# Altium schematic sheet bms_AFE_R00.SchDoc
size A1
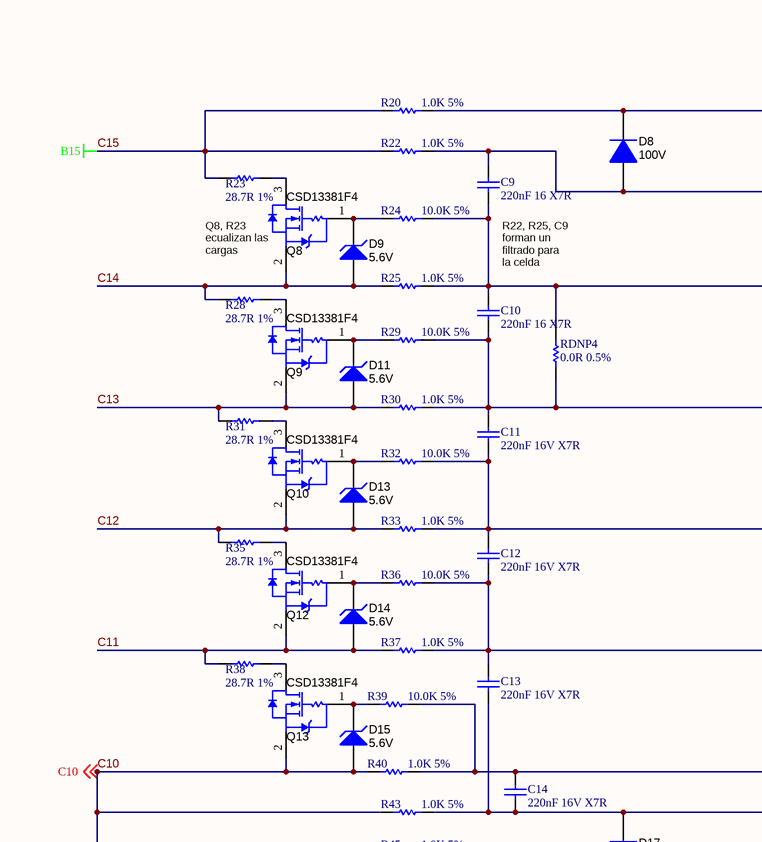
[diagram p0: bms_AFE_R00.SchDoc, top left]
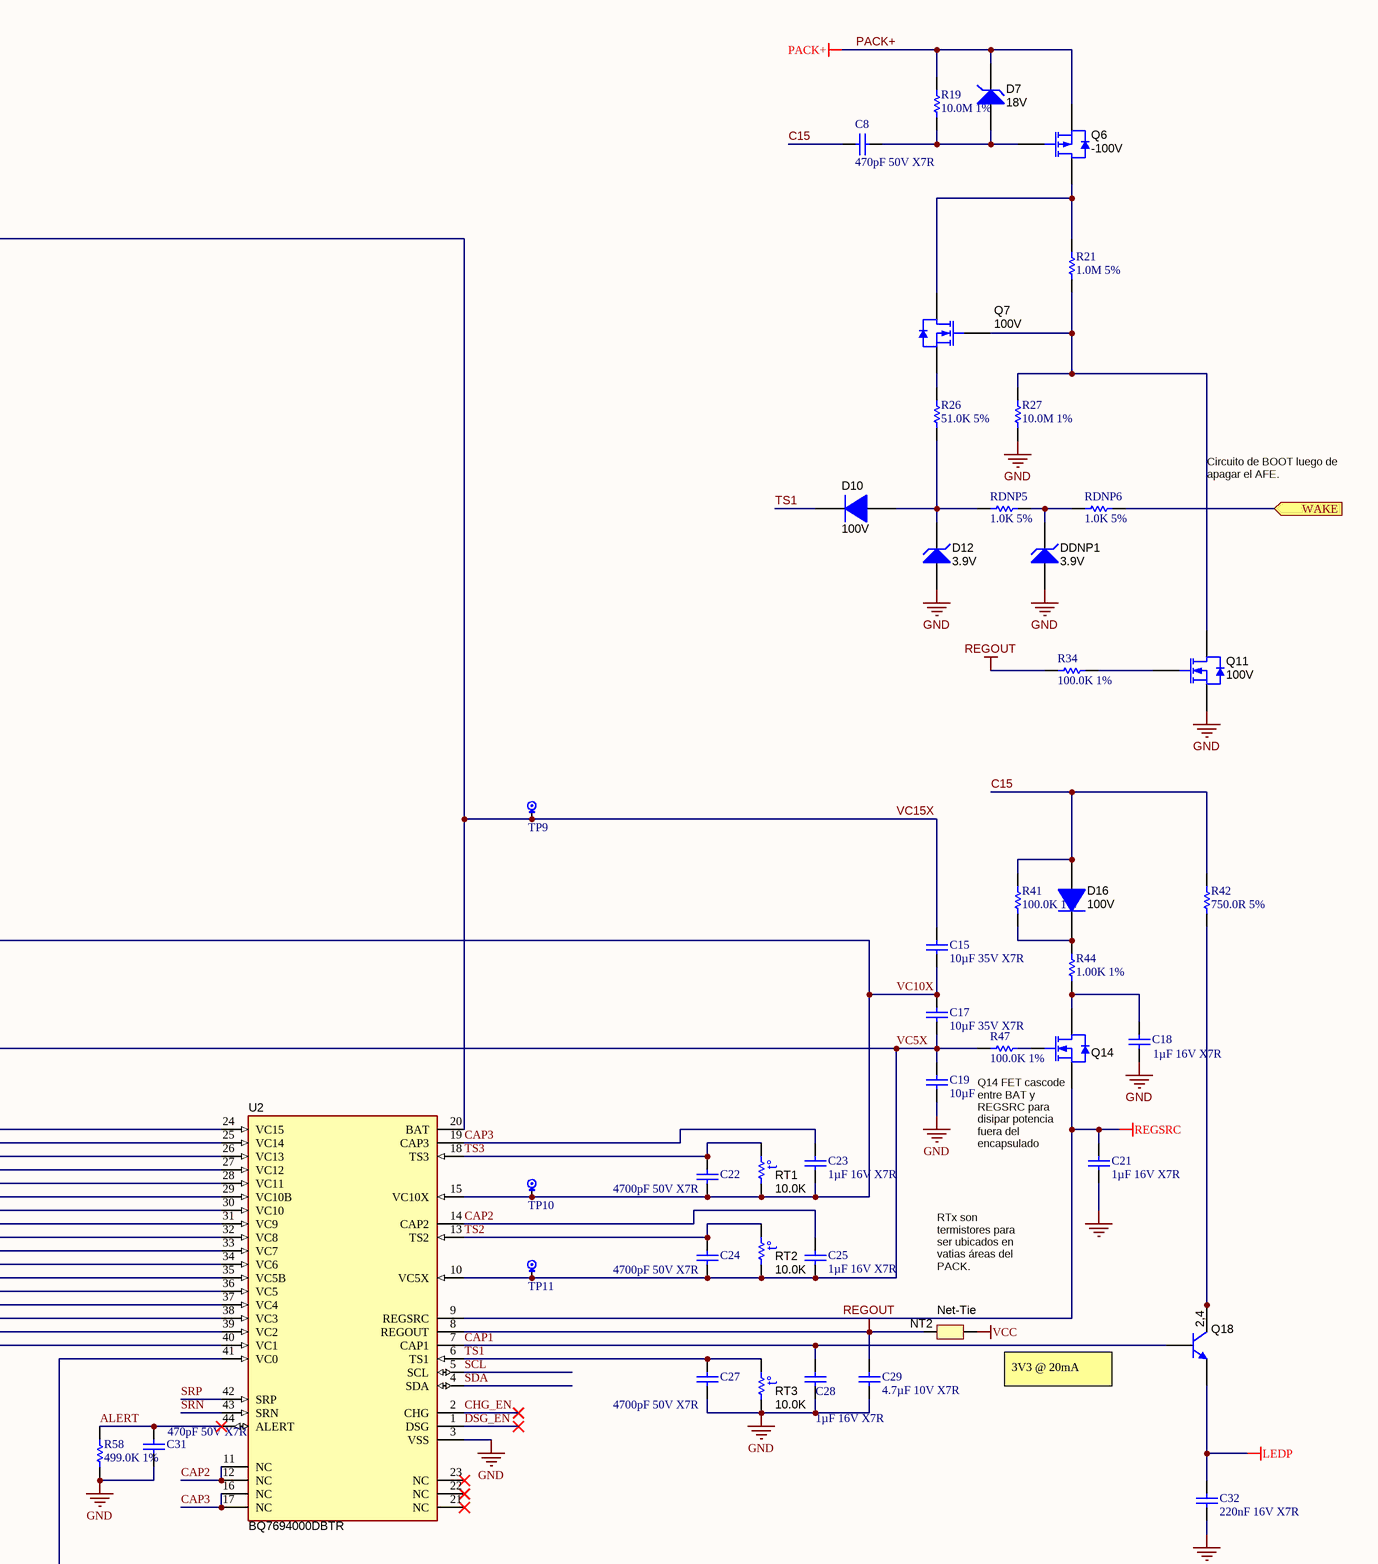
[diagram p1: bms_AFE_R00.SchDoc, top right]
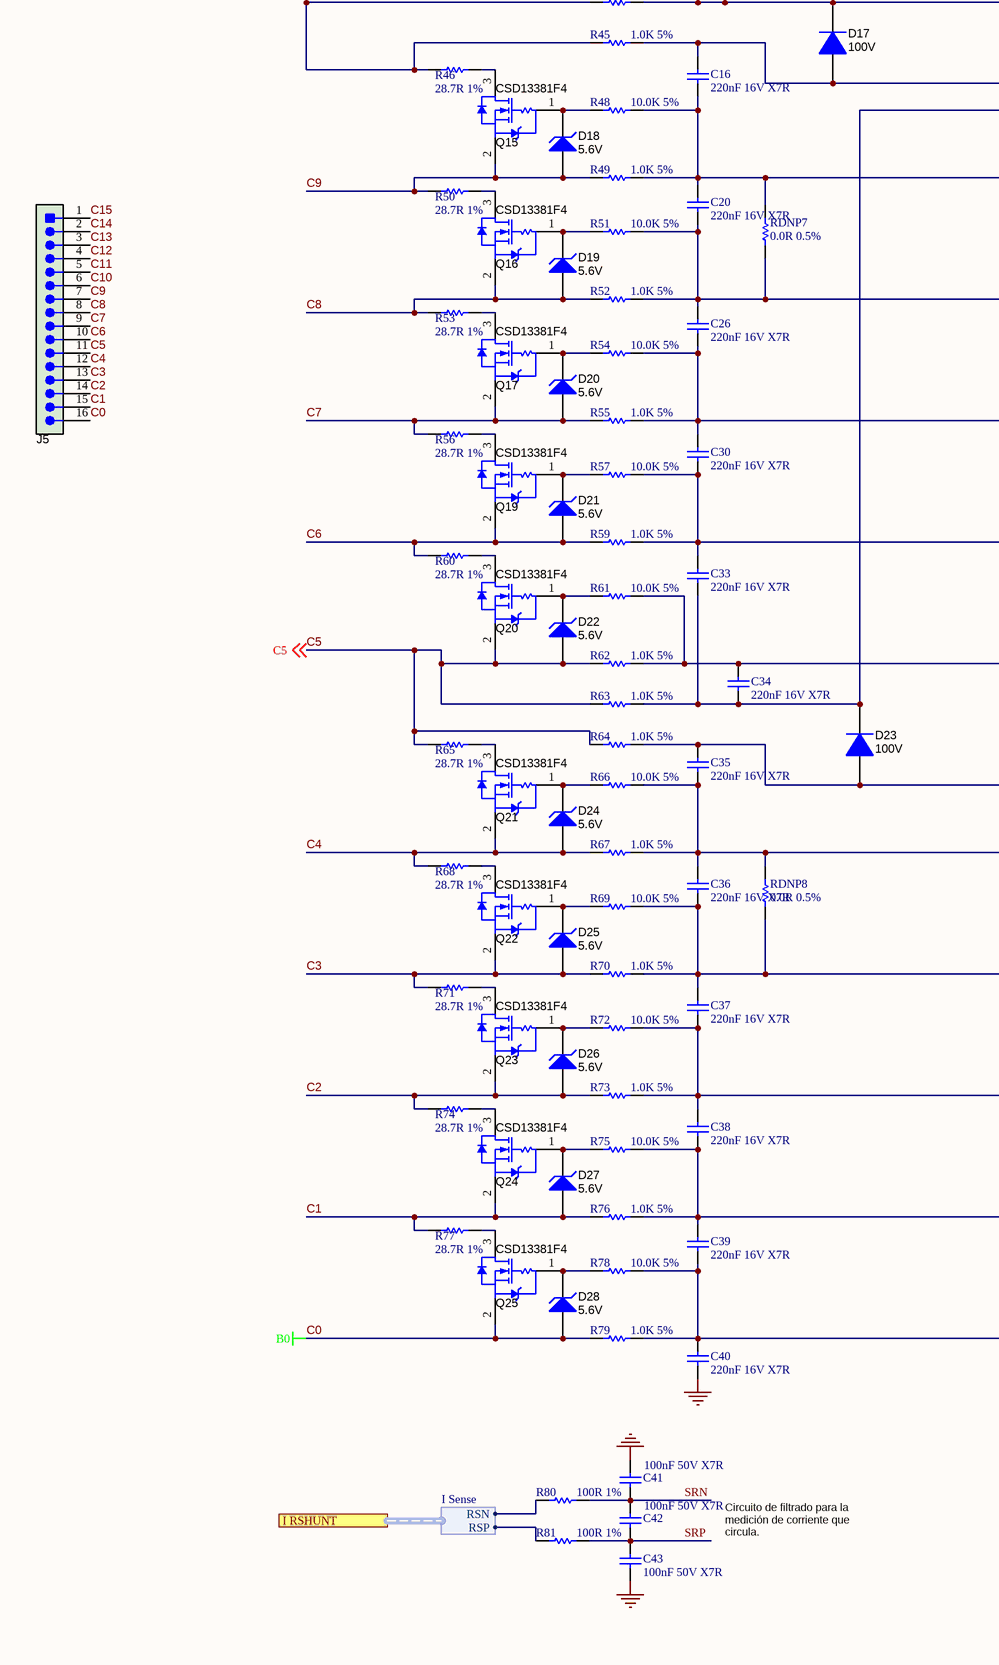
[diagram p2: bms_AFE_R00.SchDoc, bottom left]
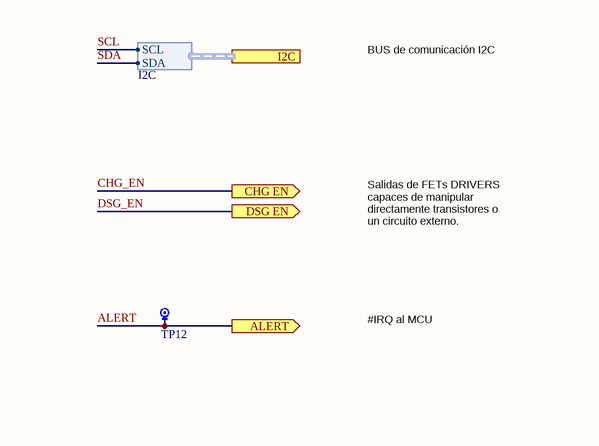
[diagram p3: bms_AFE_R00.SchDoc, bottom right]

## Parts
C8  470pF 50V X7R  [C0603]
C9  220nF 16 X7R  [C0603]
C10  220nF 16 X7R  [C0603]
C11  220nF 16V X7R  [C0603]
C12  220nF 16V X7R  [C0603]
C13  220nF 16V X7R  [C0603]
C14  220nF 16V X7R  [C0603]
C15  10µF 35V X7R  [1210_270]
C16  220nF 16V X7R  [C0603]
C17  10µF 35V X7R  [1210_270]
C18  1µF 16V X7R  [0805_HV_2]
C19  10µF  [1210_270]
C20  220nF 16V X7R  [C0603]
C21  1µF 16V X7R  [0805]
C22  4700pF 50V X7R  [C0603]
C23  1µF 16V X7R  [C0603]
C24  4700pF 50V X7R  [C0603]
C25  1µF 16V X7R  [C0603]
C26  220nF 16V X7R  [C0603]
C27  4700pF 50V X7R  [C0603]
C28  1µF 16V X7R  [C0603]
C29  4.7µF 10V X7R  [0805_HV_2]
C30  220nF 16V X7R  [C0603]
C31  470pF 50V X7R  [C0603]
C32  220nF 16V X7R  [C0603]
C33  220nF 16V X7R  [C0603]
C34  220nF 16V X7R  [C0603]
C35  220nF 16V X7R  [C0603]
C36  220nF 16V X7R  [C0603]
C37  220nF 16V X7R  [C0603]
C38  220nF 16V X7R  [C0603]
C39  220nF 16V X7R  [C0603]
C40  220nF 16V X7R  [C0603]
C41  100nF 50V X7R  [C0603]
C42  100nF 50V X7R  [C0603]
C43  100nF 50V X7R  [C0603]
D7  value 18V  [sod-323]  (hidden comment: MMSZ5248BS-7-F)
D8  value 100V  [SOD-123]  (hidden comment: 1N4148W-7-F)
D9  value 5.6V  [sod-323]  (hidden comment: MMSZ5232BS-7-F)
D10  value 100V  [SOD-123]  (hidden comment: 1N4148W-7-F)
D11  value 5.6V  [sod-323]  (hidden comment: MMSZ5232BS-7-F)
D12  value 3.9V  [sod-323]  (hidden comment: MMSZ5228BS-7-F)
D13  value 5.6V  [sod-323]  (hidden comment: MMSZ5232BS-7-F)
D14  value 5.6V  [sod-323]  (hidden comment: MMSZ5232BS-7-F)
D15  value 5.6V  [sod-323]  (hidden comment: MMSZ5232BS-7-F)
D16  value 100V  [SOD-123]  (hidden comment: 1N4148W-7-F)
D17  value 100V  [SOD-123]  (hidden comment: 1N4148W-7-F)
D18  value 5.6V  [sod-323]  (hidden comment: MMSZ5232BS-7-F)
D19  value 5.6V  [sod-323]  (hidden comment: MMSZ5232BS-7-F)
D20  value 5.6V  [sod-323]  (hidden comment: MMSZ5232BS-7-F)
D21  value 5.6V  [sod-323]  (hidden comment: MMSZ5232BS-7-F)
D22  value 5.6V  [sod-323]  (hidden comment: MMSZ5232BS-7-F)
D23  value 100V  [SOD-123]  (hidden comment: 1N4148W-7-F)
D24  value 5.6V  [sod-323]  (hidden comment: MMSZ5232BS-7-F)
D25  value 5.6V  [sod-323]  (hidden comment: MMSZ5232BS-7-F)
D26  value 5.6V  [sod-323]  (hidden comment: MMSZ5232BS-7-F)
D27  value 5.6V  [sod-323]  (hidden comment: MMSZ5232BS-7-F)
D28  value 5.6V  [sod-323]  (hidden comment: MMSZ5232BS-7-F)
DDNP1  value 3.9V  [sod-323]  (hidden comment: MMSZ5228BS-7-F)
J5  395021011  [HEADER_395021016]  (value not drawn)
NT2  Net-Tie  [Net-Tie_50milWide_30milLong]  (net tie, no BOM)
Q6  value -100V  [SOT-23]  (hidden comment: ZXMP10A13FTA)
Q7  value 100V  [SOT-23]  (hidden comment: BSS123)
Q8  CSD13381F4  [YJC0003A]
Q9  CSD13381F4  [YJC0003A]
Q10  CSD13381F4  [YJC0003A]
Q11  value 100V  [SOT-23]  (hidden comment: BSS123)
Q12  CSD13381F4  [YJC0003A]
Q13  CSD13381F4  [YJC0003A]
Q14  BST82,215  [SOT-23]  (value not drawn)
Q15  CSD13381F4  [YJC0003A]
Q16  CSD13381F4  [YJC0003A]
Q17  CSD13381F4  [YJC0003A]
Q18  ZXTN19100CZTA  [SOT-89-3]  (value not drawn)
Q19  CSD13381F4  [YJC0003A]
Q20  CSD13381F4  [YJC0003A]
Q21  CSD13381F4  [YJC0003A]
Q22  CSD13381F4  [YJC0003A]
Q23  CSD13381F4  [YJC0003A]
Q24  CSD13381F4  [YJC0003A]
Q25  CSD13381F4  [YJC0003A]
R19  10.0M 1%  [R0603]
R20  1.0K 5%  [R0603]
R21  1.0M 5%  [R0603]
R22  1.0K 5%  [R0603]
R23  28.7R 1%  [2512]
R24  10.0K 5%  [R0603]
R25  1.0K 5%  [R0603]
R26  51.0K 5%  [R0603]
R27  10.0M 1%  [R0603]
R28  28.7R 1%  [2512]
R29  10.0K 5%  [R0603]
R30  1.0K 5%  [R0603]
R31  28.7R 1%  [2512]
R32  10.0K 5%  [R0603]
R33  1.0K 5%  [R0603]
R34  100.0K 1%  [0805_HV_2]
R35  28.7R 1%  [2512]
R36  10.0K 5%  [R0603]
R37  1.0K 5%  [R0603]
R38  28.7R 1%  [2512]
R39  10.0K 5%  [R0603]
R40  1.0K 5%  [R0603]
R41  100.0K 1%  [0805_HV_2]
R42  750.0R 5%  [2010]
R43  1.0K 5%  [R0603]
R44  1.00K 1%  [2010]
R45  1.0K 5%  [R0603]
R46  28.7R 1%  [2512]
R47  100.0K 1%  [0805_HV_2]
R48  10.0K 5%  [R0603]
R49  1.0K 5%  [R0603]
R50  28.7R 1%  [2512]
R51  10.0K 5%  [R0603]
R52  1.0K 5%  [R0603]
R53  28.7R 1%  [2512]
R54  10.0K 5%  [R0603]
R55  1.0K 5%  [R0603]
R56  28.7R 1%  [2512]
R57  10.0K 5%  [R0603]
R58  499.0K 1%  [R0603]
R59  1.0K 5%  [R0603]
R60  28.7R 1%  [2512]
R61  10.0K 5%  [R0603]
R62  1.0K 5%  [R0603]
R63  1.0K 5%  [R0603]
R64  1.0K 5%  [R0603]
R65  28.7R 1%  [2512]
R66  10.0K 5%  [R0603]
R67  1.0K 5%  [R0603]
R68  28.7R 1%  [2512]
R69  10.0K 5%  [R0603]
R70  1.0K 5%  [R0603]
R71  28.7R 1%  [2512]
R72  10.0K 5%  [R0603]
R73  1.0K 5%  [R0603]
R74  28.7R 1%  [2512]
R75  10.0K 5%  [R0603]
R76  1.0K 5%  [R0603]
R77  28.7R 1%  [2512]
R78  10.0K 5%  [R0603]
R79  1.0K 5%  [R0603]
R80  100R 1%  [0805_HV_2]
R81  100R 1%  [0805_HV_2]
RDNP4  0.0R 0.5%  [R0603]
RDNP5  1.0K 5%  [R0603]
RDNP6  1.0K 5%  [R0603]
RDNP7  0.0R 0.5%  [R0603]
RDNP8  0.0R 0.5%  [R0603]
RT1  value 10.0K  [Thermistor_103AT-2]  (hidden comment: 103AT-2)
RT2  value 10.0K  [Thermistor_103AT-2]  (hidden comment: 103AT-2)
RT3  value 10.0K  [Thermistor_103AT-2]  (hidden comment: 103AT-2)
TP9  Test Point  [TEST POINT SMD 1]  (value not drawn)
TP10  Test Point  [TEST POINT SMD 1]  (value not drawn)
TP11  Test Point  [TEST POINT SMD 1]  (value not drawn)
TP12  Test Point  [TEST POINT SMD 1]  (value not drawn)
U2  BQ7694000DBTR  [DBT0044A_N]

## Ports
ALERT (out), CHG EN (out), DSG EN (out), I2C (harness I2C), I RSHUNT (harness I Sense), WAKE (in)

## Harnesses
I2C: SCL, SDA
I Sense: RSP, RSN

## Nets
C0: D28.2(A) J5.16 Q25.2(S) R79.1  [also labelled B0]
C15: C8.2 D16.2(A) J5.1 R20.1 R22.1 R23.2 R41.2 R42.2  [also labelled B15]
GND: C18.1 C19.1 C21.1 C27.1 C28.1 C29.1 C31.1 C32.1 C40.1 C41.2 C43.1 D12.2(A) DDNP1.2(A) Q11.2(S) R27.1 R58.1 RT3.1 U2.3(VSS)
LEDP: C32.2 Q18.3(E)
PACK+: D7.1(K) Q6.2(S) R19.2
REGOUT: C29.2 NT2.1 R34.2 U2.8(REGOUT)
REGSRC: C21.2 Q14.2(S) U2.9(REGSRC)
VCC: NT2.2
ALERT: C31.2 R58.2 TP12.1 U2.44(ALERT) ; port ALERT
C1: D27.2(A) J5.15 Q24.2(S) R76.1 R77.2
C2: D26.2(A) J5.14 Q23.2(S) R73.1 R74.2
C3: D25.2(A) J5.13 Q22.2(S) R70.1 R71.2
C4: D24.2(A) J5.12 Q21.2(S) R67.1 R68.2
C5: D22.2(A) J5.11 Q20.2(S) R62.1 R63.1 R64.1 R65.2 ; off-sheet C5
C6: D21.2(A) J5.10 Q19.2(S) R59.1 R60.2
C7: D20.2(A) J5.9 Q17.2(S) R55.1 R56.2
C8: D19.2(A) J5.8 Q16.2(S) R52.1 R53.2
C9: D18.2(A) J5.7 Q15.2(S) R49.1 R50.2
C10: D15.2(A) J5.6 Q13.2(S) R40.1 R43.1 R45.1 R46.2 ; off-sheet C10
C11: D14.2(A) J5.5 Q12.2(S) R37.1 R38.2
C12: D13.2(A) J5.4 Q10.2(S) R33.1 R35.2
C13: D11.2(A) J5.3 Q9.2(S) R30.1 R31.2
C14: D9.2(A) J5.2 Q8.2(S) R25.1 R28.2
CAP1: C28.2 Q18.1(B) U2.7(CAP1)
CAP2: C25.2 U2.11(NC) U2.12(NC) U2.14(CAP2)
CAP3: C23.2 U2.16(NC) U2.17(NC) U2.19(CAP3)
CHG_EN: U2.2(CHG) ; port CHG EN
DSG_EN: U2.1(DSG) ; port DSG EN
SCL: U2.5(SCL) ; port I2C.SCL
SDA: U2.4(SDA) ; port I2C.SDA
SRN: C41.1 C42.2 R80.2 U2.43(SRN)
SRP: C42.1 C43.2 R81.2 U2.42(SRP)
TS1: C27.2 D10.1(K) RT3.2 U2.6(TS1)
TS2: C24.2 RT2.2 U2.13(TS2)
TS3: C22.2 RT1.2 U2.18(TS3)
VC5X: C17.1 C19.2 C24.1 C25.1 C33.1 C34.1 D23.1(K) R47.1 R63.2 RT2.1 TP11.1 U2.10(VC5X)
VC10X: C13.1 C14.1 C15.1 C17.2 C22.1 C23.1 D17.1(K) R43.2 RT1.1 TP10.1 U2.15(VC10X)
VC15X: C15.2 D8.1(K) R20.2 TP9.1 U2.20(BAT)
WAKE: RDNP6.1 ; port WAKE
NetC8_1: C8.1 D7.2(A) Q6.1(G) R19.1
NetC9_1: C9.1 C10.2 R24.2 R25.2 RDNP4.2 U2.25(VC14)
NetC9_2: C9.2 D8.2(A) R22.2 U2.24(VC15)
NetC10_1: C10.1 C11.2 R29.2 R30.2 RDNP4.1 U2.26(VC13)
NetC11_1: C11.1 C12.2 R32.2 R33.2 U2.27(VC12)
NetC12_1: C12.1 C13.2 R36.2 R37.2 U2.28(VC11)
NetC14_2: C14.2 R39.2 R40.2 U2.29(VC10B)
NetC16_1: C16.1 C20.2 R48.2 R49.2 RDNP7.2 U2.31(VC9)
NetC16_2: C16.2 D17.2(A) R45.2 U2.30(VC10)
NetC18_2: C18.2 Q14.3(D) R44.1
NetC20_1: C20.1 C26.2 R51.2 R52.2 RDNP7.1 U2.32(VC8)
NetC26_1: C26.1 C30.2 R54.2 R55.2 U2.33(VC7)
NetC30_1: C30.1 C33.2 R57.2 R59.2 U2.34(VC6)
NetC34_2: C34.2 R61.2 R62.2 U2.35(VC5B)
NetC35_1: C35.1 C36.2 R66.2 R67.2 RDNP8.2 U2.37(VC4)
NetC35_2: C35.2 D23.2(A) R64.2 U2.36(VC5)
NetC36_1: C36.1 C37.2 R69.2 R70.2 RDNP8.1 U2.38(VC3)
NetC37_1: C37.1 C38.2 R72.2 R73.2 U2.39(VC2)
NetC38_1: C38.1 C39.2 R75.2 R76.2 U2.40(VC1)
NetC39_1: C39.1 C40.2 R78.2 R79.2 U2.41(VC0)
NetD9_1: D9.1(K) Q8.1(G) R24.1
NetD10_2: D10.2(A) D12.1(K) R26.1 RDNP5.2
NetD11_1: D11.1(K) Q9.1(G) R29.1
NetD13_1: D13.1(K) Q10.1(G) R32.1
NetD14_1: D14.1(K) Q12.1(G) R36.1
NetD15_1: D15.1(K) Q13.1(G) R39.1
NetD16_1: D16.1(K) R41.1 R44.2
NetD18_1: D18.1(K) Q15.1(G) R48.1
NetD19_1: D19.1(K) Q16.1(G) R51.1
NetD20_1: D20.1(K) Q17.1(G) R54.1
NetD21_1: D21.1(K) Q19.1(G) R57.1
NetD22_1: D22.1(K) Q20.1(G) R61.1
NetD24_1: D24.1(K) Q21.1(G) R66.1
NetD25_1: D25.1(K) Q22.1(G) R69.1
NetD26_1: D26.1(K) Q23.1(G) R72.1
NetD27_1: D27.1(K) Q24.1(G) R75.1
NetD28_1: D28.1(K) Q25.1(G) R78.1
NetDDNP1_1: DDNP1.1(K) RDNP5.1 RDNP6.2
NetQ6_3: Q6.3(D) Q7.3(D) R21.2
NetQ7_1: Q7.1(G) Q11.3(D) R21.1 R27.2
NetQ7_2: Q7.2(S) R26.2
NetQ8_3: Q8.3(D) R23.1
NetQ9_3: Q9.3(D) R28.1
NetQ10_3: Q10.3(D) R31.1
NetQ11_1: Q11.1(G) R34.1
NetQ12_3: Q12.3(D) R35.1
NetQ13_3: Q13.3(D) R38.1
NetQ14_1: Q14.1(G) R47.2
NetQ15_3: Q15.3(D) R46.1
NetQ16_3: Q16.3(D) R50.1
NetQ17_3: Q17.3(D) R53.1
NetQ18_2: Q18.2(C) Q18.4(C) R42.1
NetQ19_3: Q19.3(D) R56.1
NetQ20_3: Q20.3(D) R60.1
NetQ21_3: Q21.3(D) R65.1
NetQ22_3: Q22.3(D) R68.1
NetQ23_3: Q23.3(D) R71.1
NetQ24_3: Q24.3(D) R74.1
NetQ25_3: Q25.3(D) R77.1
NetR80_1: R80.1 ; port I RSHUNT.RSN
NetR81_1: R81.1 ; port I RSHUNT.RSP

Not connected (* = marked no-connect by the designer): U2 21(NC)* 22(NC)* 23(NC)*

## Notes on the sheet
- Q8, R23 ecualizan las cargas
- R22, R25, C9 forman un filtrado para la celda
- Circuito de BOOT luego de apagar el AFE.
- (near Q14) Q14 FET cascode entre BAT y REGSRC para disipar potencia fuera del encapsulado
- (near NT2) RTx son termistores para ser ubicados en vatias áreas del PACK.
- (near NT2) 3V3 @ 20mA
- BUS de comunicación I2C
- Salidas de FETs DRIVERS capaces de manipular directamente transistores o un circuito externo.
- #IRQ al MCU
- Circuito de filtrado para la medición de corriente que circula.
- (in symbol 103AT-2) t°
- (in symbol ZXTN19100CZTA, Diodes Inc.) 2,4

## Library data of the parts
C8-C14 C16 C20 C22-C28 C30-C43 = Cap 0603: Capacitor
C15 C17 C19 = Cap 1210: Capacitor
C18 C29 = Cap 0805_HV: Capacitor
C21 = Cap 0805: Capacitor
D7 = MMSZ5248BS-7-F: Diode, Zener, 18 V, 200 mW, SOD-323; Manufacturer: Diodes Inc.; SymbolCreator: a0412235; U/M: EA; Power_W: 0.2; Vz_V: 18; Value1: 0.2W; RJA_CperW: 350; AEC Category: Q101; SymbolVersion: 2010-08-25; PartNumber: MMSZ5248BS-7-F; PackageReference: SOD-323; CompType: Zener; Vr_V: N/A; MountType: SMT; RoHS: Y; ComponentLink1Description: Datasheet link; ComponentLink1URL: http://www.diodes.com/datasheets/ds31038.pdf; Published: 2008-10-08; Publisher: Texas Instruments; LatestRevisionDate: 2016-01-12; LatestRevisionNote: Updated Supplier Data; Supplier 1: Digi-Key; Supplier Part Number 1: MMSZ5248BS-FDICT-ND; Supplier 2: Mouser; Supplier Part Number 2: 621-MMSZ5248BS-F; Supplier 3: Farnell; Supplier Part Number 3: 1858632; AEC Qualified: ?
D8 D10 D16 D17 D23 = 1N4148W-7-F: Diode, Ultrafast, 100V, 0.15A, SOD-123; Manufacturer: Diodes Inc.; U/M: EA; Vf_V: 1.25; Io_A: 0.15; Vr_V: 100; Value2: 1.25V; TJmax_C: 150; ComponentLink1URL: http://www.diodes.com/datasheets/ds30086.pdf; SymbolVersion: 2008-12-08; PackageReference: SOD-123; PartNumber: 1N4148W-7-F; ComponentLink1Description: Datasheet link; CompType: Diode; MountType: SMT; RoHS: Y; Value1: 0.15A; Type: Ultrafast; Published: 2008-06-26; Publisher: Texas Instruments; LatestRevisionDate: 2013-10-23; Supplier 1: Digi-Key; Supplier Part Number 1: 1N4148W-FDICT-ND; Supplier 2: Mouser; Supplier Part Number 2: 621-1N4148W-F; Supplier 3: Farnell; Supplier Part Number 3: 1776392
D9 D11 D13-D15 D18-D22 D24-D28 = MMSZ5232BS-7-F: Diode, Zener, 5.6V, 200mW, SOD-323; Manufacturer: Diodes Inc.; U/M: EA; Power_W: 0.2; Vz_V: 5.6; Value1: 0.2W; RJA_CperW: 350; CompType: Zener; SymbolVersion: 2010-08-25; PartNumber: MMSZ5232BS-7-F; PackageReference: SOD-323; Vr_V: N/A; MountType: SMT; RoHS: Y; ComponentLink1Description: Datasheet link; ComponentLink1URL: http://www.diodes.com/datasheets/ds31038.pdf; Published: 2008-10-08; Publisher: Texas Instruments; LatestRevisionDate: 2013-02-11; LatestRevisionNote: Updated Supplier Data; Supplier 1: Digi-Key; Supplier Part Number 1: MMSZ5232BS-FDICT-ND; Supplier 2: Mouser; Supplier Part Number 2: 621-MMSZ5232BS-F
D12 DDNP1 = MMSZ5228BS-7-F: Diode, Zener, 3.9 V, 200 mW, SOD-323; Manufacturer: Diodes Inc.; SymbolCreator: a0412235; U/M: EA; Power_W: 0.2; Vz_V: 3.9; Value1: 0.2W; RJA_CperW: 350; AEC Category: Q101; SymbolVersion: 2010-08-25; PartNumber: MMSZ5228BS-7-F; PackageReference: SOD-323; CompType: Zener; Vr_V: N/A; MountType: SMT; RoHS: Y; ComponentLink1Description: Datasheet link; ComponentLink1URL: http://www.diodes.com/datasheets/ds31038.pdf; Published: 2008-10-08; Publisher: Texas Instruments; LatestRevisionDate: 2016-04-07; LatestRevisionNote: Updated Supplier Data; Supplier 1: Digi-Key; Supplier Part Number 1: MMSZ5228BS-FDICT-ND; Supplier 2: Mouser; Supplier Part Number 2: 621-MMSZ5228BS-F; AEC Qualified: ?
J5 = 395021016: Terminal block, 3.5mm, 16x1, R/A, TH; Manufacturer: Molex; SymbolCreator: a0799628; U/M: EA; SymbolVersion: 2013-12-22; PartNumber: 395021011; PackageReference: 39.90x7.03x9.33 mm; CompType: Terminal Block; RoHS: Y; MountType: TH; ComponentLink1Description: Datasheet Link; ComponentLink1URL: http://www.molex.com/pdm_docs/sd/395021002_sd.pdf; Publisher: Texas Instruments; LatestRevisionDate: 2015-02-18; Supplier 1: Digi-Key; Supplier Part Number 1: WM7779-ND; Supplier 2: Mouser; Supplier Part Number 2: 538-39502-1011
NT2 = Net-Tie: Single point connection between nets.; SymbolCreator: codlsc; SymbolVersion: 2009-07-01; MountType: SMT; PackageReference: N/A; Publisher: Texas Instruments; LatestRevisionDate: 2015-10-18; LatestRevisionNote: Added Alternate PartNumber and Alternate Manufacturer parameters to appropriate components.
Q6 = ZXMP10A13FTA: MOSFET, P-CH, -100V, -0.6A, SOT-23; Manufacturer: Diodes Inc.; Alternate Manufacturer: None; U/M: EA; ChType: P; VdsMax_V: -100; Value1: 1 ohm; Rdson45_Ohm: 1; Value2: 3.5 nC; QgTyp_nC: 3.5; Vgs_V: -4; IdsMax_A: -0.6; SymbolVersion: 2008-07-09; PartNumber: ZXMP10A13FTA; PackageReference: SOT-23; CompType: MOSFET; RoHS: Y; MountType: SMT; Published: 2008-06-19; Publisher: Texas Instruments; LatestRevisionDate: 2013-12-01; LatestRevisionNote: Added parts.; ComponentLink1Description: Datasheet link; ComponentLink1URL: http://www.diodes.com/datasheets/ZXMP10A13F.pdf; Supplier 1: Digi-Key; Supplier Part Number 1: ZXMP10A13FCT-ND; Supplier 2: Mouser; Supplier Part Number 2: 522-ZXMP10A13FTA; Supplier 3: Farnell; Supplier Part Number 3: 1843777
Q7 Q11 = BSS123: MOSFET, N-CH, 100V, 0.17A, SOT-23; Manufacturer: Fairchild Semiconductor; Alternate Manufacturer: None; U/M: EA; ChType: N; VdsMax_V: 100; Value1: 10 ohm; Rdson45_Ohm: 10; Value2: 1.8 nC; QgTyp_nC: 1.8; Vgs_V: 20; IdsMax_A: 0.17; SymbolVersion: 2008-07-28; CompType: MOSFET; PartNumber: BSS123; PackageReference: SOT-23; RoHS: Y; MountType: SMT; Published: 2008-06-19; Publisher: Texas Instruments; LatestRevisionDate: 2013-10-21; LatestRevisionNote: Added parts.; ComponentLink1Description: Datasheet link; ComponentLink1URL: http://www.fairchildsemi.com/ds/BS/BSS123.pdf; Supplier 1: Digi-Key; Supplier Part Number 1: BSS123NCT-ND; Supplier 2: Mouser; Supplier Part Number 2: 512-BSS123; Supplier 3: Farnell; Supplier Part Number 3: 9845321
Q8-Q10 Q12 Q13 Q15-Q17 Q19-Q25 = CSD13381F4: MOSFET, N/P-CH, 12 V, 2.1 A, 1.0x0.35x0.6mm; Manufacturer: Texas Instruments; Alternate Manufacturer: None; SymbolCreator: a0411947; U/M: EA; ChType: N; Value: 12V; VdsMax_V: 12; Value1: 0.14 ohm; Rdson45_ohm: 0.14; Value2: 1.06 nC; QgTyp_nC: 1.06; Vgs_V: 8; IdsMax_A: 2.1; SymbolVersion: 2013-11-21; PartNumber: CSD13381F4; PackageReference: 1.0x0.35x0.6mm; CompType: MOSFET; RoHS: Y; MountType: SMT; Published: 2008-06-19; Publisher: Texas Instruments; LatestRevisionDate: 2015-02-19; LatestRevisionNote: Added parts.; ComponentLink1Description: Datasheet link; ComponentLink1URL: http://www.ti.com/lit/ds/symlink/csd13381f4.pdf; Supplier 1: Digi-Key; Supplier Part Number 1: CSD13381F4-ND; Supplier 2: Mouser; Supplier Part Number 2: 595-CSD13381F4; Supplier 3: Newark; Supplier Part Number 3: 11X3112
Q14 = BST82,215: MOSFET, N-CH, 100 V, 0.19 A, SOT-23; Manufacturer: NXP Semiconductor; Alternate Manufacturer: None; U/M: EA; ChType: N; Value: 100V; VdsMax_V: 100; Value1: 10 ohm; Rdson45_ohm: 10; Value2: ? nC; Vgs_V: 20; IdsMax_A: 0.19; AEC Category: Q101; SymbolVersion: 2008-07-28; CompType: MOSFET; PartNumber: BST82,215; PackageReference: SOT-23; RoHS: Y; MountType: SMT; Published: 2008-06-19; Publisher: Texas Instruments; LatestRevisionDate: 2016-03-03; LatestRevisionNote: Added parts.; ComponentLink1Description: Datasheet link; ComponentLink1URL: http://www.nxp.com/documents/data_sheet/BST82.pdf; Supplier 1: Digi-Key; Supplier Part Number 1: 568-6229-1-ND; Supplier 2: Mouser; Supplier Part Number 2: 771-BST82215; Supplier 3: Newark; Supplier Part Number 3: 75R4704; AEC Qualified: ?
Q18 = ZXTN19100CZTA, Diodes Inc.: Transistor, NPN, 100 V, 5.25 A, SOT-89; SymbolCreator: a0412235; PNP: 0; NPN: 1; Vceo_V: 100; Vcesat1_V: 0.21; Value: 100 V; IcRated_A: 5.25; Value1: 5.25 A; HfeMax: 500; TaMin_C: -55; TaMax_C: 150; CompType: BJT; U/M: EA; AEC Category: Q101; SymbolVersion: 2009-09-01; PartNumber: ZXTN19100CZTA; Manufacturer: Diodes Inc.; PackageReference: SOT-89; RoHS: Y; Value2: 500; Published: 2008-07-31; LatestRevisionDate: 2016-02-25; Publisher: Texas Instruments; ComponentLink1Description: Datasheet link; ComponentLink1URL: http://www.diodes.com/datasheets/ZXTN19100CZ.pdf; Supplier 1: Digi-Key; Supplier Part Number 1: ZXTN19100CZCT-ND; Supplier 2: Mouser; Supplier Part Number 2: 621-ZXTN19100CZTA; MountType: SMT; AEC Qualified: ?
R19-R79 RDNP4-RDNP8 = Res: Resistor
R80 R81 = Res 0805_HV: Resistor
RT1-RT3 = 103AT-2: Thermistor NTC, 10.0k ohm, 1%, Disc, 5x8.4 mm; Manufacturer: SEMITEC Corporation; Tolerance_%: 1; Power_W: 0.01; TaMin_C: -50; TaMax_C: 110; U/M: EA; ComponentLink1URL: http://www.semitec.co.jp/english2/products/pdf/AT_Thermistor.pdf; PackageReference: Disc, 5x8.4 mm; SymbolVersion: 2008-11-25; PartNumber: 103AT-2; ComponentLink1Description: Datasheet link; CompType: ThermistorNTC; Series: AT; MountType: TH; RoHS: Y; Published: 2009-09-22; Publisher: Texas Instruments; LatestRevisionDate: 2013-08-16; Supplier 1: Mouser; Supplier Part Number 1: 954-103AT-2
U2 = BQ7694000DBTR: Battery Monitor for Lithium-Ion and Phosphate Battery Packs, DBT0044A; Manufacturer: Texas Instruments; SymbolCreator: a0412235; CompType: IC; U/M: EA; SymbolVersion: 2012-12-21; PartNumber: BQ7694000DBTR; Alternate PartNumber: BQ7694000DBT; PackageReference: DBT0044A; MountType: SMT; ComponentLink1Description: Datasheet Link; ComponentLink1URL: http://www.ti.com/lit/gpn/bq76920; RoHS: Y; Publisher: Texas Instruments; LatestRevisionDate: 2016-02-12; Alternate Manufacturer: Texas Instruments